# EAGLE design 10BASE-T1L (EAGLE 9.6.2)

## Sheet 1 of 2
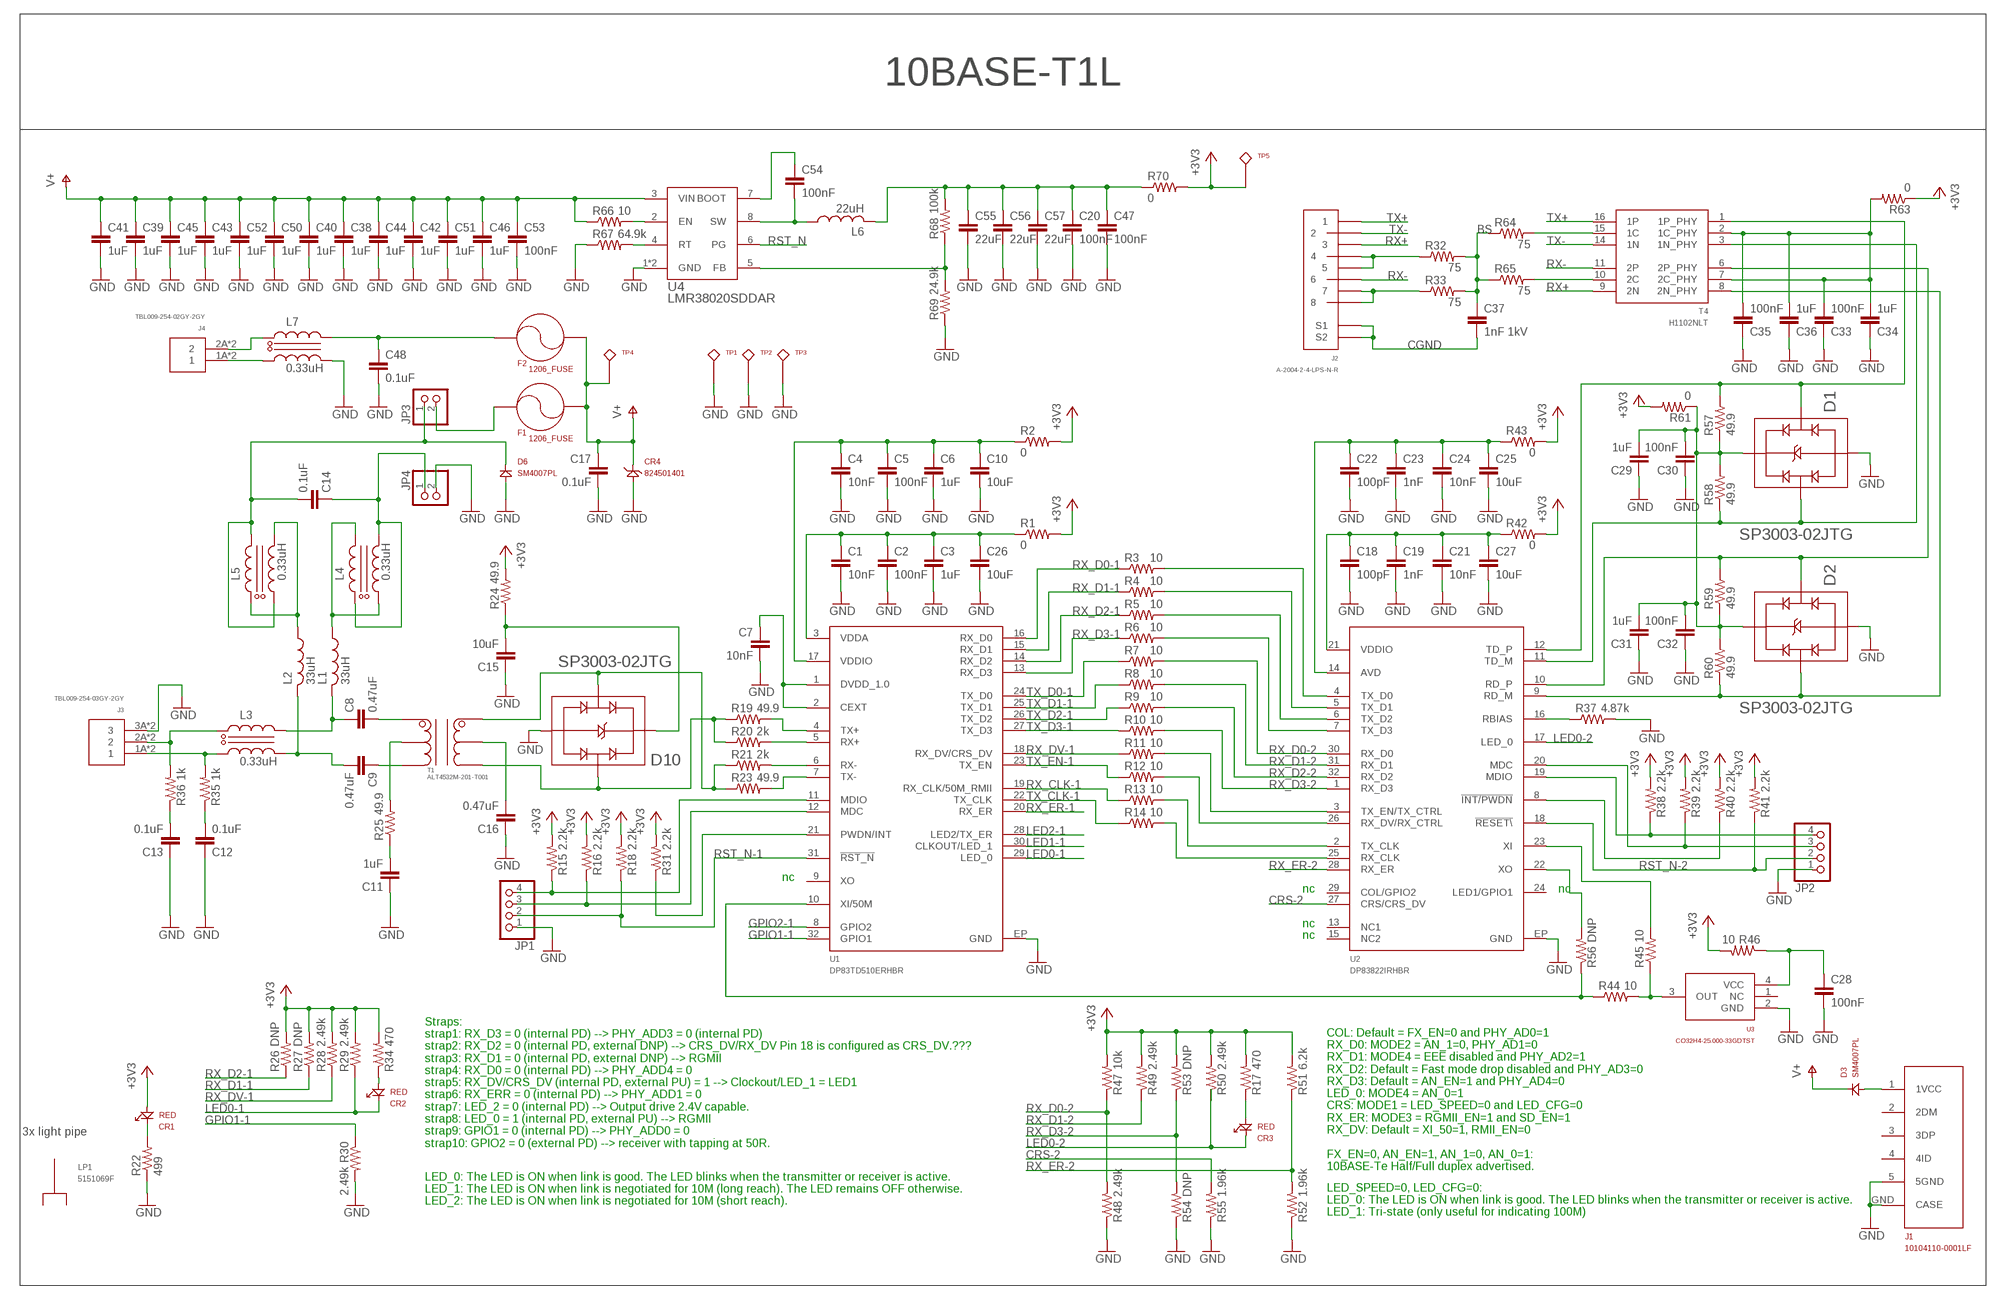
[diagram p0: schematic, sheet 1]

### Parts
C1  10nF  0603_CAPACITOR  [0603]
C2  100nF  0603_CAPACITOR  [0603]
C3  1uF  0603_CAPACITOR  [0603]
C4  10nF  0603_CAPACITOR  [0603]
C5  100nF  0603_CAPACITOR  [0603]
C6  1uF  0603_CAPACITOR  [0603]
C7  10nF  0603_CAPACITOR  [0603]
C8  0.47uF  0603_CAPACITOR  [0603]
C9  0.47uF  0603_CAPACITOR  [0603]
C10  10uF  0805_CAPACITOR  [0805]
C11  1uF  0603_CAPACITOR  [0603]
C12  0.1uF  0603_CAPACITOR  [0603]
C13  0.1uF  0603_CAPACITOR  [0603]
C14  0.1uF  0603_CAPACITOR  [0603]
C15  10uF  0603_CAPACITOR  [0603]
C16  0.47uF  0603_CAPACITOR  [0603]
C17  0.1uF  0603_CAPACITOR  [0603]
C18  100pF  0603_CAPACITOR  [0603]
C19  1nF  0603_CAPACITOR  [0603]
C20  100nF  0603_CAPACITOR  [0603]
C21  10nF  0603_CAPACITOR  [0603]
C22  100pF  0603_CAPACITOR  [0603]
C23  1nF  0603_CAPACITOR  [0603]
C24  10nF  0603_CAPACITOR  [0603]
C25  10uF  0805_CAPACITOR  [0805]
C26  10uF  0805_CAPACITOR  [0805]
C27  10uF  0805_CAPACITOR  [0805]
C28  100nF  0603_CAPACITOR  [0603]
C29  1uF  0603_CAPACITOR  [0603]
C30  100nF  0603_CAPACITOR  [0603]
C31  1uF  0603_CAPACITOR  [0603]
C32  100nF  0603_CAPACITOR  [0603]
C33  100nF  0603_CAPACITOR  [0603]
C34  1uF  0603_CAPACITOR  [0603]
C35  100nF  0603_CAPACITOR  [0603]
C36  1uF  0603_CAPACITOR  [0603]
C37  1nF 1kV  C-EUC1206  [C1206]
C38  1uF  C-EUC1206  [C1206]
C39  1uF  C-EUC1206  [C1206]
C40  1uF  C-EUC1206  [C1206]
C41  1uF  C-EUC1206  [C1206]
C42  1uF  C-EUC1206  [C1206]
C43  1uF  C-EUC1206  [C1206]
C44  1uF  C-EUC1206  [C1206]
C45  1uF  C-EUC1206  [C1206]
C46  1uF  C-EUC1206  [C1206]
C47  100nF  0603_CAPACITOR  [0603]
C48  0.1uF  0603_CAPACITOR  [0603]
C50  1uF  C-EUC1206  [C1206]
C51  1uF  C-EUC1206  [C1206]
C52  1uF  C-EUC1206  [C1206]
C53  100nF  0603_CAPACITOR  [0603]
C54  100nF  0603_CAPACITOR  [0603]
C55  22uF  C-EUC1206  [C1206]
C56  22uF  C-EUC1206  [C1206]
C57  22uF  C-EUC1206  [C1206]
CR1  RED  150060RS75000  [0603_DIODE]
CR2  RED  150060RS75000  [0603_DIODE]
CR3  RED  150060RS75000  [0603_DIODE]
CR4  824501401  [DO-214AC]
D1  SP3003-02JTG  [SC-70-5]
D2  SP3003-02JTG  [SC-70-5]
D3  SM4007PL  [SOD123(AK)]
D6  SM4007PL  [SOD123(AK)]
D10  SP3003-02JTG  [SC-70-5]
F1  1206_FUSE  [1206]
F2  1206_FUSE  [1206]
J1  10104110-0001LF  [MICRO_USB]
J2  A-2004-2-4-LPS-N-R  [A-2004-2-4-LPS-N-R]
J3  TBL009-254-03GY-2GY  [TBL009-254-03GY-2GY]
J4  TBL009-254-02GY-2GY  [TBL009-254-02GY-2GY]
JP1  PINHD-1X4  [1X04]
JP2  PINHD-1X4  [1X04]
JP3  PINHD-1X2  [1X02]
JP4  PINHD-1X2  [1X02]
L1  33uH  FWP201610P-R33ML  [0806]
L2  33uH  FWP201610P-R33ML  [0806]
L3  0.33uH  SDCW2520S-2-601TF  [SDCW2520]
L4  0.33uH  SDCW2520S-2-601TF  [SDCW2520]
L5  0.33uH  SDCW2520S-2-601TF  [SDCW2520]
L6  22uH  APW12A10  [APW12A10]
L7  0.33uH  SDCW2520S-2-601TF  [SDCW2520]
LP1  5151069F  [5151069F]
R1  0  0603_RESISTOR  [0603]
R2  0  0603_RESISTOR  [0603]
R3  10  0603_RESISTOR  [0603]
R4  10  0603_RESISTOR  [0603]
R5  10  0603_RESISTOR  [0603]
R6  10  0603_RESISTOR  [0603]
R7  10  0603_RESISTOR  [0603]
R8  10  0603_RESISTOR  [0603]
R9  10  0603_RESISTOR  [0603]
R10  10  0603_RESISTOR  [0603]
R11  10  0603_RESISTOR  [0603]
R12  10  0603_RESISTOR  [0603]
R13  10  0603_RESISTOR  [0603]
R14  10  0603_RESISTOR  [0603]
R15  2.2k  0603_RESISTOR  [0603]
R16  2.2k  0603_RESISTOR  [0603]
R17  470  0603_RESISTOR  [0603]
R18  2.2k  0603_RESISTOR  [0603]
R19  49.9  0603_RESISTOR  [0603]
R20  2k  0603_RESISTOR  [0603]
R21  2k  0603_RESISTOR  [0603]
R22  499  0603_RESISTOR  [0603]
R23  49.9  0603_RESISTOR  [0603]
R24  49.9  0603_RESISTOR  [0603]
R25  49.9  0603_RESISTOR  [0603]
R26  DNP  0603_RESISTOR  [0603]
R27  DNP  0603_RESISTOR  [0603]
R28  2.49k  0603_RESISTOR  [0603]
R29  2.49k  0603_RESISTOR  [0603]
R30  2.49k  0603_RESISTOR  [0603]
R31  2.2k  0603_RESISTOR  [0603]
R32  75  0603_RESISTOR  [0603]
R33  75  0603_RESISTOR  [0603]
R34  470  0603_RESISTOR  [0603]
R35  1k  0603_RESISTOR  [0603]
R36  1k  0603_RESISTOR  [0603]
R37  4.87k  0603_RESISTOR  [0603]
R38  2.2k  0603_RESISTOR  [0603]
R39  2.2k  0603_RESISTOR  [0603]
R40  2.2k  0603_RESISTOR  [0603]
R41  2.2k  0603_RESISTOR  [0603]
R42  0  0603_RESISTOR  [0603]
R43  0  0603_RESISTOR  [0603]
R44  10  0603_RESISTOR  [0603]
R45  10  0603_RESISTOR  [0603]
R46  10  0603_RESISTOR  [0603]
R47  10k  0603_RESISTOR  [0603]
R48  2.49k  0603_RESISTOR  [0603]
R49  2.49k  0603_RESISTOR  [0603]
R50  2.49k  0603_RESISTOR  [0603]
R51  6.2k  0603_RESISTOR  [0603]
R52  1.96k  0603_RESISTOR  [0603]
R53  DNP  0603_RESISTOR  [0603]
R54  DNP  0603_RESISTOR  [0603]
R55  1.96k  0603_RESISTOR  [0603]
R56  DNP  0603_RESISTOR  [0603]
R57  49.9  0603_RESISTOR  [0603]
R58  49.9  0603_RESISTOR  [0603]
R59  49.9  0603_RESISTOR  [0603]
R60  49.9  0603_RESISTOR  [0603]
R61  0  0603_RESISTOR  [0603]
R63  0  0603_RESISTOR  [0603]
R64  75  0603_RESISTOR  [0603]
R65  75  0603_RESISTOR  [0603]
R66  10  0603_RESISTOR  [0603]
R67  64.9k  0603_RESISTOR  [0603]
R68  100k  0603_RESISTOR  [0603]
R69  24.9k  0603_RESISTOR  [0603]
R70  0  0603_RESISTOR  [0603]
T1  ALT4532M-201-T001  [TDK_ALT]
T4  H1102NLT  [H1102NLT]
TP1  5011  [5010]
TP2  5011  [5010]
TP3  5011  [5010]
TP4  5010  [5010]
TP5  5010  [5010]
U1  DP83TD510ERHBR  [QFN32-55_TI]
U2  DP83822IRHBR  [QFN32-55_TI]
U3  CO32H4-25.000-33GDTST  [3.2X2.5_4SMD]
U4  LMR38020SDDAR  [SOIC8_TP_TI]

### Nets
3V3R: C20.1 C47.1 C55.1 C56.1 C57.1 L6.P$2 R68.2 R70.1
+3V3: CR1.A R1.2 R2.2 R15.2 R16.2 R17.2 R18.2 R24.2 R26.2 R27.2 R28.2 R29.2 R31.2 R34.2 R38.2 R39.2 R40.2 R41.2 R42.2 R43.2 R46.2 R47.2 R49.2 R50.2 R51.2 R53.2 R61.2 R63.1 R70.2 TP5.P$1
BS: C37.1 R32.2 R33.2 R64.1 R65.1
CEXT_L: C7.1 U1.1(DVDD_1.0) U1.2(CEXT)
CGND: C37.2 J2.S1 J2.S2
CRS-2: R55.2 U2.27(CRS/CRS_DV)
GND: C1.2 C2.2 C3.2 C4.2 C5.2 C6.2 C7.2 C10.2 C11.1 C12.1 C13.1 C15.1 C16.1 C17.2 C18.2 C19.2 C20.2 C21.2 C22.2 C23.2 C24.2 C25.2 C26.2 C27.2 C28.2 C29.1 C30.1 C31.1 C32.1 C33.1 C34.1 C35.1 C36.1 C38.2 C39.2 C40.2 C41.2 C42.2 C43.2 C44.2 C45.2 C46.2 C47.2 C48.2 C50.2 C51.2 C52.2 C53.2 C55.2 C56.2 C57.2 CR4.A D1.2(GND) D2.2(GND) D6.A D10.2(GND) J1.5(5GND) J1.GND(CASE) J3.3A J3.3B JP1.1 JP2.1 JP4.2 L7.B2(2OUT) R22.1 R30.2 R37.2 R48.1 R52.1 R54.1 R55.1 R67.1 R69.1 TP1.P$1 TP2.P$1 TP3.P$1 U1.EP(GND) U2.EP(GND) U3.2(GND) U4.1(GND) U4.TP(GND)
GPIO1-1: R30.1 U1.32(GPIO1)
GPIO2-1: U1.8(GPIO2)
LED0-1: CR2.K R29.1 U1.29(LED_0)
LED0-2: CR3.K R50.1 U2.17(LED_0)
LED1-1: U1.30(CLKOUT/LED_1)
LED2-1: U1.28(LED2/TX_ER)
N$1: C48.1 F2.1 L7.A2(1OUT)
N$2: C8.2 T1.1
N$3: CR3.A R17.1
N$4: J2.4 J2.5 R32.1
N$5: J2.7 J2.8 R33.1
N$6: CR2.A R34.1
N$7: JP1.4 R15.1 U1.11(MDIO)
N$8: JP1.3 R16.1 U1.12(MDC)
N$9: R31.1 U1.21(PWDN/INT)
N$10: D3.A J1.1(1VCC)
N$11: R56.2 U2.22(XO)
N$12: J4.1A J4.1B L7.B1(2IN)
N$13: R14.2 U2.25(RX_CLK)
N$14: C9.1 T1.2
N$16: R25.2 T1.6
N$17: C8.1 L1.P$2 L3.A2(1OUT)
N$18: C9.2 L2.P$2 L3.B2(2OUT)
N$19: CR1.K R22.2
N$20: L1.P$1 L4.A2(1OUT) L4.B1(2IN)
N$21: L2.P$1 L5.A1(1IN) L5.B2(2OUT)
N$22: R13.2 U2.2(TX_CLK)
N$24: R12.2 U2.26(RX_DV/RX_CTRL)
N$25: R11.2 U2.3(TX_EN/TX_CTRL)
N$26: C14.2 D6.K JP3.1 L5.A2(1OUT) L5.B1(2IN)
N$28: C14.1 JP4.1 L4.A1(1IN) L4.B2(2OUT)
N$29: R64.2 T4.15(1C)
N$30: R6.2 U2.7(TX_D3)
N$31: R5.2 U2.6(TX_D2)
N$32: R4.2 U2.5(TX_D1)
N$33: R3.2 U2.4(TX_D0)
N$34: J4.2A J4.2B L7.A1(1IN)
N$35: F1.1 JP3.2
N$36: J3.1A J3.1B L3.B1(2IN) R35.2
N$37: C11.2 R25.1
N$40: C16.2 T1.3
N$41: R45.2 U2.23(XI)
N$42: C13.2 R36.1
N$48: C12.2 R35.1
N$49: J3.2A J3.2B L3.A1(1IN) R36.2
N$50: C15.2 D10.3(VCC) R24.1
N$56: JP2.3 R39.1 U2.20(MDC)
N$57: JP2.4 R38.1 U2.19(MDIO)
N$58: R40.1 U2.8(!INT/PWDN)
N$59: R68.1 R69.2 U4.5(FB)
N$60: R37.1 U2.16(RBIAS)
N$61: R44.2 R45.1 U3.3(OUT)
N$62: C28.1 R46.1 U3.4(VCC)
N$63: R44.1 R56.1 U1.10(XI/50M)
N$64: R65.2 T4.10(2C)
N$68: C54.1 U4.7(BOOT)
N$71: R67.2 U4.4(RT)
N$72: R66.2 U4.2(EN)
RD_N [Diff]: D2.5(IO1) R60.1 T4.8(2N_PHY) U2.9(RD_M)
RD_P [Diff]: D2.4(IO2) R59.2 T4.6(2P_PHY) U2.10(RD_P)
RST_N [Diff]: U4.6(PG)
RST_N-1 [Diff]: JP1.2 R18.1 U1.31(!RST_N)
RST_N-2 [Diff]: JP2.2 R41.1 U2.18(!RESET\)
RX+: J2.3 T4.9(2N)
RX-: J2.6 T4.11(2P)
RX_CLK-1: R13.1 U1.19(RX_CLK/50M_RMII)
RX_D0-1: R3.1 U1.16(RX_D0)
RX_D0-2: R7.2 R47.1 R48.2 U2.30(RX_D0)
RX_D1-1: R4.1 R27.1 U1.15(RX_D1)
RX_D1-2: R8.2 R49.1 U2.31(RX_D1)
RX_D2-1: R5.1 R26.1 U1.14(RX_D2)
RX_D2-2: R9.2 U2.32(RX_D2)
RX_D3-1: R6.1 U1.13(RX_D3)
RX_D3-2: R10.2 R53.1 R54.2 U2.1(RX_D3)
RX_DV-1: R11.1 R28.1 U1.18(RX_DV/CRS_DV)
RX_ER-1: U1.20(RX_ER)
RX_ER-2: R51.1 R52.2 U2.28(RX_ER)
RXR_N [Diff]: R21.2 U1.6(RX-)
RXR_P [Diff]: R20.2 U1.5(RX+)
SW: C54.2 L6.P$1 U4.8(SW)
T1L_N [Diff]: D10.5(IO1) R21.1 R23.1 T1.5
T1L_P [Diff]: D10.4(IO2) R19.1 R20.1 T1.4
TCT: C33.2 C34.2 C35.2 C36.2 R63.2 T4.2(1C_PHY) T4.7(2C_PHY)
TCT2: C29.2 C30.2 C31.2 C32.2 D1.3(VCC) D2.3(VCC) R57.1 R58.2 R59.1 R60.2 R61.1
TD_N [Diff]: D1.5(IO1) R58.1 T4.3(1N_PHY) U2.11(TD_M)
TD_P [Diff]: D1.4(IO2) R57.2 T4.1(1P_PHY) U2.12(TD_P)
TX+: J2.1 T4.16(1P)
TX-: J2.2 T4.14(1N)
TX_CLK-1: R14.1 U1.22(TX_CLK)
TX_D0-1: R7.1 U1.24(TX_D0)
TX_D1-1: R8.1 U1.25(TX_D1)
TX_D2-1: R9.1 U1.26(TX_D2)
TX_D3-1: R10.1 U1.27(TX_D3)
TX_EN-1: R12.1 U1.23(TX_EN)
TXR_N [Diff]: R23.2 U1.7(TX-)
TXR_P [Diff]: R19.2 U1.4(TX+)
V+ [HV]: C17.1 C38.1 C39.1 C40.1 C41.1 C42.1 C43.1 C44.1 C45.1 C46.1 C50.1 C51.1 C52.1 C53.1 CR4.C(K) D3.K F1.2 F2.2 R66.1 TP4.P$1 U4.3(VIN)
VDDA_L: C1.1 C2.1 C3.1 C26.1 R1.1 U1.3(VDDA)
VDDA_L1: C18.1 C19.1 C21.1 C27.1 R42.1 U2.21(VDDIO)
VDDIO_L: C4.1 C5.1 C6.1 C10.1 R2.1 U1.17(VDDIO)
VDDIO_L1: C22.1 C23.1 C24.1 C25.1 R43.1 U2.14(AVD)
Unconnected: J1.2(2DM) J1.3(3DP) J1.4(4ID) U1.9(XO) U2.13(NC1) U2.15(NC2) U2.24(LED1/GPIO1) U2.29(COL/GPIO2) U3.1(NC)

### Notes on the sheet
- 10BASE-T1L
- nc
- nc | nc
- nc
- nc
- 3x light pipe
- Straps:
  strap1: RX_D3 = 0 (internal PD) --> PHY_ADD3 = 0 (internal PD) 
  strap2: RX_D2 = 0 (internal PD, external DNP) --> CRS_DV/RX_DV Pin 18 is configured as CRS_DV.???
  strap3: RX_D1 = 0 (internal PD, external DNP) --> RGMII
  strap4: RX_D0 = 0 (internal PD) --> PHY_ADD4 = 0
  strap5: RX_DV/CRS_DV (internal PD, external PU) = 1 --> Clockout/LED_1 = LED1
  strap6: RX_ERR = 0 (internal PD) --> PHY_ADD1 = 0
  strap7: LED_2 = 0 (internal PD) --> Output drive 2.4V capable.
  strap8: LED_0 = 1 (internal PD, external PU) --> RGMII
  strap9: GPIO1 = 0 (internal PD) --> PHY_ADD0 = 0
  strap10: GPIO2 = 0 (external PD) --> receiver with tapping at 50R.
- COL: Default = FX_EN=0 and PHY_AD0=1
  RX_D0: MODE2 = AN_1=0, PHY_AD1=0
  RX_D1: MODE4 = EEE disabled and PHY_AD2=1
  RX_D2: Default = Fast mode drop disabled and PHY_AD3=0
  RX_D3: Default = AN_EN=1 and PHY_AD4=0
  LED_0: MODE4 = AN_0=1
  CRS: MODE1 = LED_SPEED=0 and LED_CFG=0
  RX_ER: MODE3 = RGMII_EN=1 and SD_EN=1
  RX_DV: Default = XI_50=1, RMII_EN=0
  
  FX_EN=0, AN_EN=1, AN_1=0, AN_0=1:
  10BASE-Te Half/Full duplex advertised.
- LED_0: The LED is ON when link is good. The LED blinks when the transmitter or receiver is active. 
  LED_1: The LED is ON when link is negotiated for 10M (long reach). The LED remains OFF otherwise. 
  LED_2: The LED is ON when link is negotiated for 10M (short reach).
- LED_SPEED=0, LED_CFG=0:
  LED_0: The LED is ON when link is good. The LED blinks when the transmitter or receiver is active. 
  LED_1: Tri-state (only useful for indicating 100M)

## Sheet 2 of 2

## Library data of the parts
C1-C9 C11-C24 C28-C36 C47 C48 C53 C54 = ruark2:0603_CAPACITOR: 0603 Capacitor -- WARNING: NO DEFINED VALUE OR PART NUMBER; VALUE: sel
C10 C25-C27 = ruark2:0805_CAPACITOR: NO DEFINED PN
C37-C46 C50-C52 C55-C57 = rcl:C-EU: CAPACITOR, European symbol; SPICEPREFIX: C
CR1-CR3 = ruark2:150060RS75000: Red 625nm LED Indication - Discrete 2V 0603 (1608 Metric); PARTNO: 732-4978-1-ND
CR4 = ruark2:824501401: 64.5V Clamp 6.1A Ipp Tvs Diode Surface Mount DO-214AC; PARTNO: 732-9960-1-ND
D1 D2 D10 = ruark2:SP3003-02JTG: 15V Clamp 2.5A (8/20µs) Ipp Tvs Diode Surface Mount SC-70-5 JLCPCB: C151302; PARTNO: F3301CT-ND
D3 D6 = ruark2:SM4007PL: 1A 1kV 1.1V@1A SOD-123FL Diodes - General Purpose ROHS JLCPCB: C64898
F1 F2 = ruark2:1206_FUSE
J1 = ruark2:10104110-0001LF: USB - micro B USB 2.0 Receptacle Connector 5 Position Surface Mount, Right Angle; PARTNO: 609-4052-1-ND
J2 = ruark2:A-2004-2-4-LPS-N-R: Jack Modular Connector 8p8c (RJ45, Ethernet) 90° Angle (Right) Shielded Asian alternate: RCH RC00994; PARTNO: AE10387-ND
J3 = ruark2:TBL009-254-03GY-2GY: 3 Position Wire to Board Terminal Block Horizontal with Board 0.100" (2.54mm) Through Hole; PARTNO: 102-TBL009-254-03GY-2GY-ND
J4 = ruark2:TBL009-254-02GY-2GY: 2 Position Wire to Board Terminal Block Horizontal with Board 0.100" (2.54mm) Through Hole; PARTNO: 102-TBL009-254-02GY-2GY-ND
JP1 JP2 = pinhead:PINHD-1X4: PIN HEADER
JP3 JP4 = pinhead:PINHD-1X2: PIN HEADER
L1 L2 = ruark2:FWP201610P-R33ML: 4.1A 0.33uH ±20% Molding Choke 0806 Power Inductors ROHS
L3-L5 L7 = ruark2:SDCW2520S-2-601TF: 600Ω@100MHz 0.38Ω 2 1008 Common Mode Filters ROHS JLCPCB: C843574
L6 = ruark2:APW12A10: 22uH ±20% 4.95A SMD Power Inductors ROHS JLCPCB: C311499
LP1 = ruark2:5151069F: Light Pipe 3 Wide Clear Rigid Board Mount, Press Fit, Right Angle; PARTNO: 350-2182-ND
R1-R61 R63-R70 = ruark2:0603_RESISTOR: 0603 Resistor -- WARNING: NO DEFINED PART NUMBER OR VALUE; VALUE: sel
T1 = ruark2:ALT4532M-201-T001: 200µH LAN Pulse Transformer 1CT:1CT Surface Mount JLCPCB: C2845101; PARTNO: 445-15085-1-ND
T4 = ruark2:H1102NLT
TP1-TP3 = ruark2:5011: Black PC Test Point, Multipurpose Phosphor Bronze, Silver Plating 0.063" (1.60mm) Hole Diameter Mounting Type; PARTNO: 36-5011-ND
TP4 TP5 = ruark2:5010: Red PC Test Point, Multipurpose Phosphor Bronze, Silver Plating 0.063" (1.60mm) Hole Diameter Mounting Type; PARTNO: 36-5010-ND
U1 = ruark2:DP83TD510ERHBR: 1/1 Transceiver 10BASE-T1L IEEE 802.3 32-VQFN (5x5); PARTNO: 296-DP83TD510ERHBRCT-ND
U2 = ruark2:DP83822IRHBR: 10/100 Ethernet PHY RGMII/RMII/MII; PARTNO: 296-44794-1-ND
U3 = ruark2:CO32H4-25.000-33GDTST: 3.3V~3.3V ±50ppm 25MHz HCMOS SMD3225-4P Oscillators ROHS 4-SMD, No Lead
U4 = ruark2:LMR38020SDDAR: Buck Switching Regulator IC Positive Adjustable 1V 1 Output 2A 8-PowerSOIC (0.154", 3.90mm Width); PARTNO: 296-LMR38020SDDARCT-ND

## Net classes
1 HV: clearance 0.406 mm
2 Diff: width 0.18 mm, clearance 0.152 mm

## Board
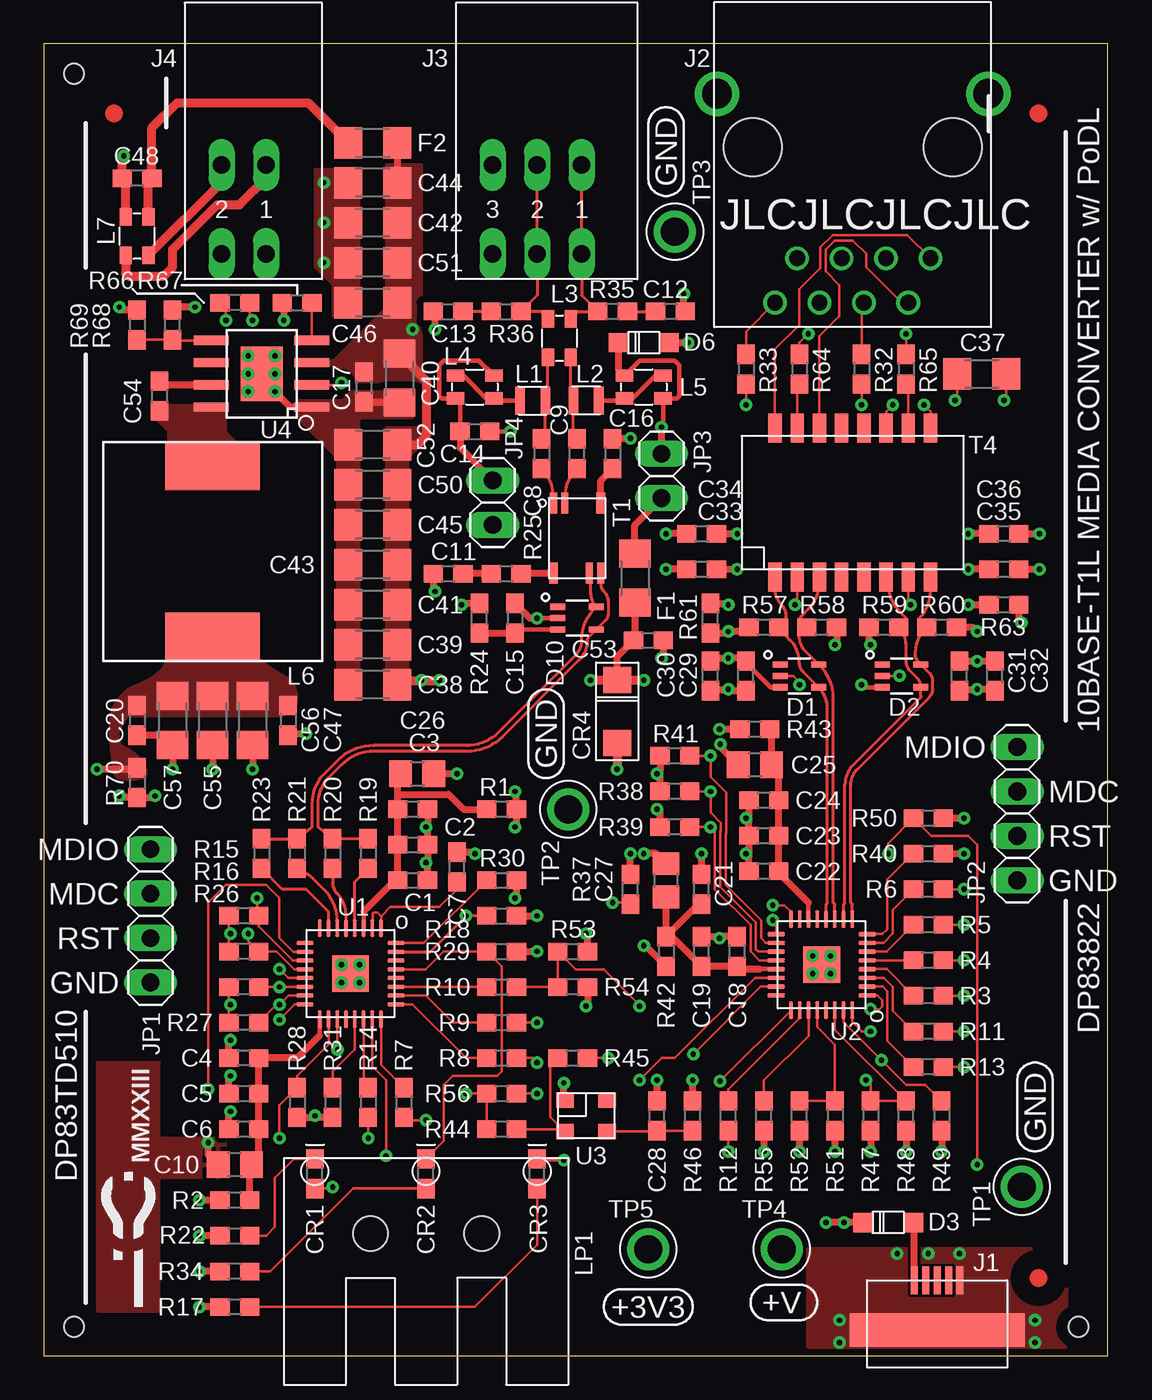
[diagram p1: board, top side]
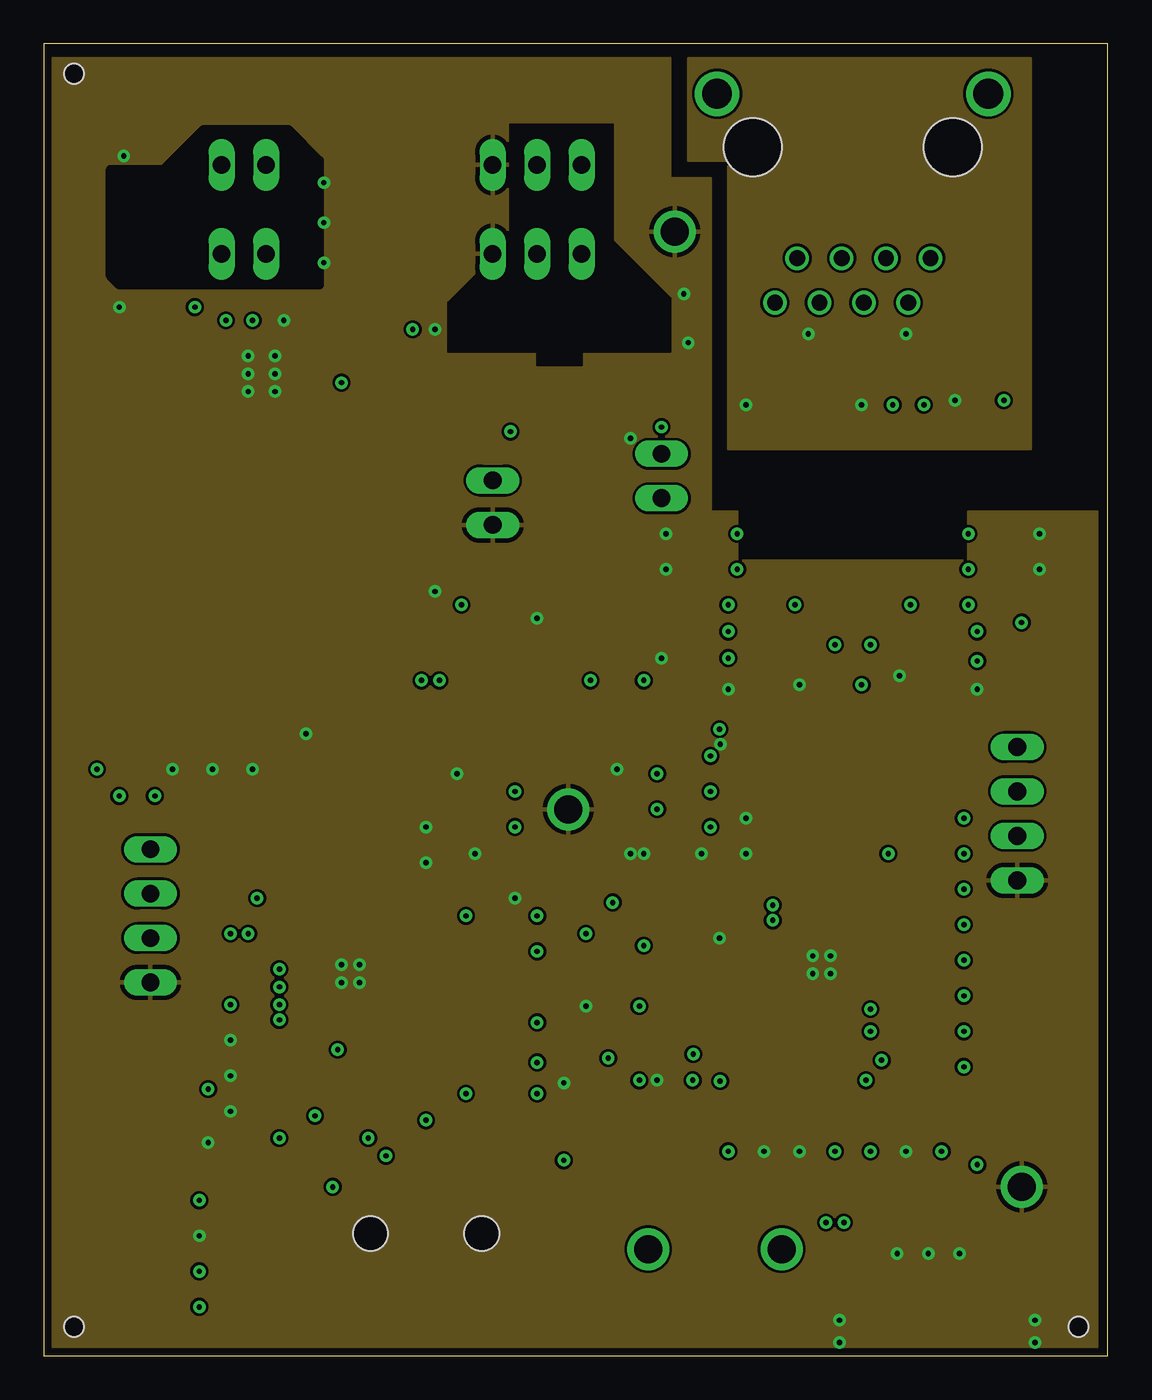
[diagram p2: board, inner layer Route2]
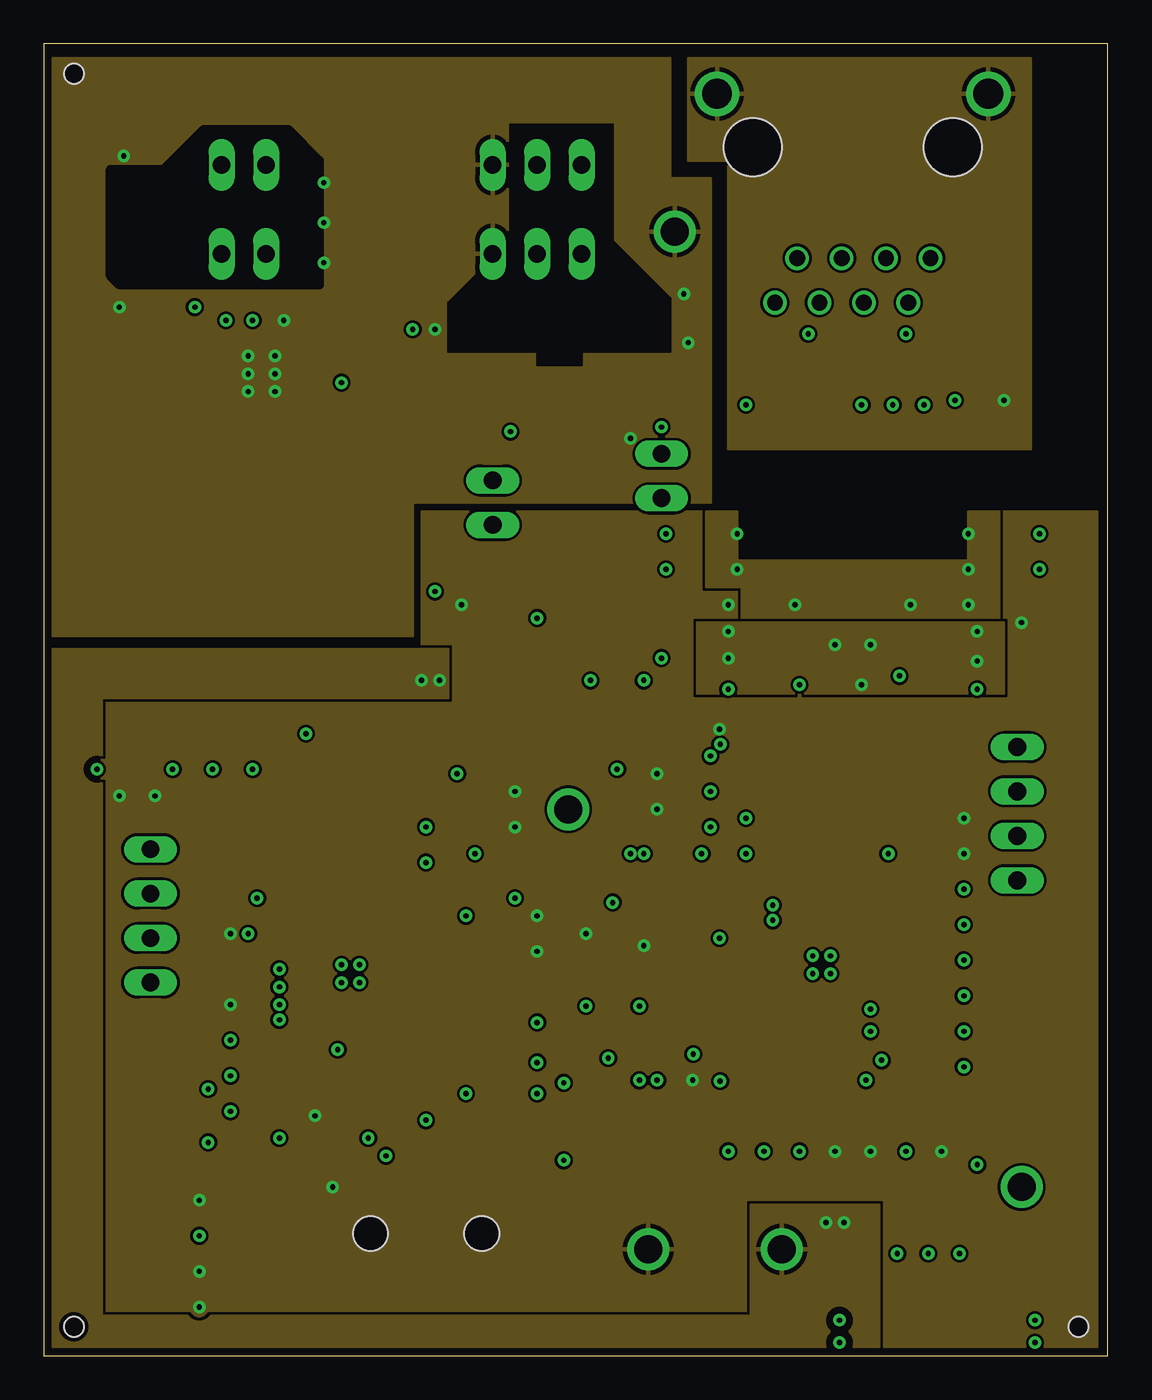
[diagram p3: board, inner layer Route15]
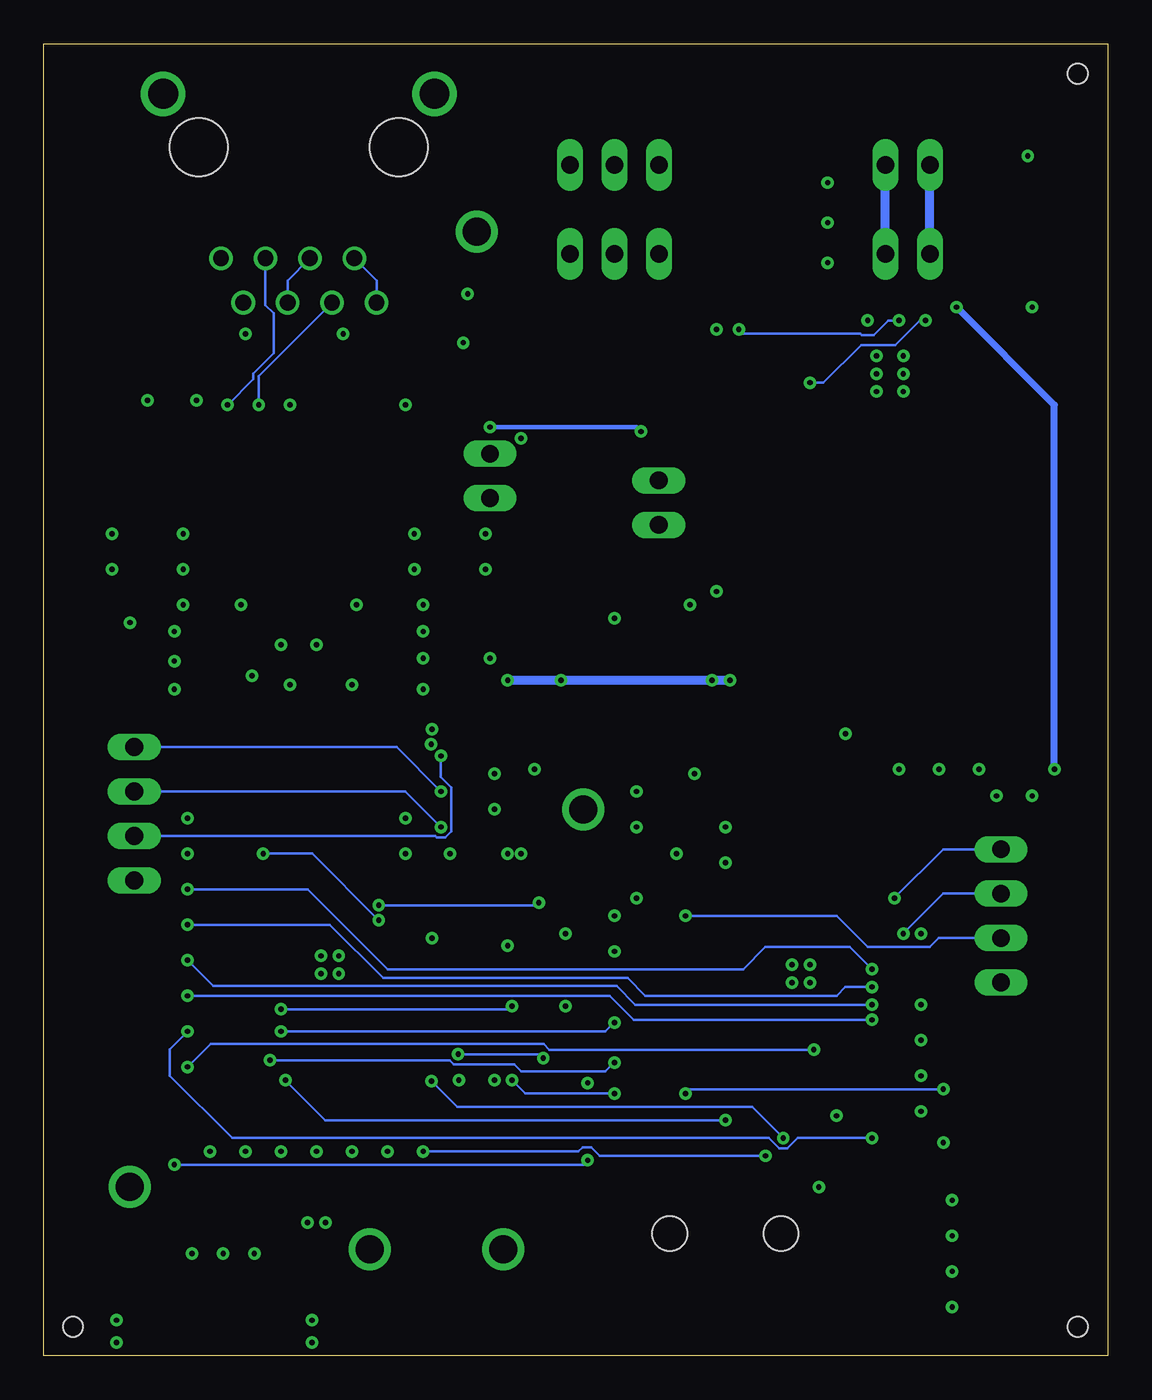
[diagram p4: board, bottom side, seen from below]

Size 60.8 x 75 mm. Coordinates in mm from the lower left corner, seen from the top.
Outline: 0,0 60.8,0 60.8,75 0,75 0,0
Copper layers (1+2*15+16): Top 0.035mm / dielectric 1.5mm / Route2 0.035mm / dielectric 0.15mm / Route15 0.035mm / dielectric 0.2mm / Bottom 0.035mm
Design rules "default *": minimum track width 6mil, minimum drill 12mil, track to track 6mil, track to pad 6mil, pad to pad 6mil, via to via 6mil, smd to smd 6mil, copper to edge 0mil, drill to drill 6mil, minimum pad ring 0.13mm, minimum via ring 8mil, stop-mask expansion 4mil, vias tented up to drill 12mil, thermal gap 10mil
Holes 1.15 mm at 1.73,1.66 1.73,73.29 59.13,1.66
tRestrict: area 0.7,0.6 to 2.7,2.7; area 0.7,72.3 to 2.7,74.3; area 58.1,0.6 to 60.1,2.7; area 2.9,69.9 to 5.1,72.1; area 55.7,69.9 to 57.9,72.1; area 55.7,3.4 to 57.9,5.6
bRestrict: area 16.9,5.2 to 20.4,8.8; area 23.2,5.2 to 26.8,8.8

### Footprints (pad centres in the part's own frame; a part is rotated, then mirrored left to right if it is on the bottom)
0603 = smd 1.1 x 1: 1 -0.85,0; 2 0.85,0
0805 = smd 1.3 x 1.5: 1 -0.95,0; 2 0.95,0
C1206 = smd 1.6 x 1.8: 1 -1.4,0; 2 1.4,0
0603_DIODE = smd 1.1 x 1: A -0.85,0; K 0.85,0
DO-214AC = smd 1.5 x 1.6: A -1.8,0; C 1.8,0
SC-70-5 = smd 0.85 x 0.35: 1 -1.1,0.65; 2 -1.1,0; 3 -1.1,-0.65; 4 1.1,-0.65; 5 1.1,0.65
SOD123(AK) = smd 1.1 x 1.1: A 1.45,0; K -1.45,0
1206 = smd 1.6 x 1.8: 1 -1.4,0; 2 1.4,0
MICRO_USB = smd 0.4 x 1.6: 1 -1.3,0; 2 -0.65,0; 3 0,0; 4 0.65,0; 5 1.3,0 | smd 10 x 1.9: GND 0,-2.84
A-2004-2-4-LPS-N-R = drill 0.9: 1 4.445,-6.35; 2 3.175,-8.89; 3 1.905,-6.35; 4 0.635,-8.89; 5 -0.635,-6.35; 6 -1.905,-8.89; 7 -3.175,-6.35; 8 -4.445,-8.89 | drill 1.7: S1 -7.75,3.05; S2 7.75,3.05 | hole 3.35: -5.715,0; 5.715,0
TBL009-254-03GY-2GY = drill 1 long: 1A -2.54,-2.54; 1B -2.54,2.54; 2A 0,-2.54; 2B 0,2.54; 3A 2.54,-2.54; 3B 2.54,2.54
TBL009-254-02GY-2GY = drill 1 long: 1A -1.27,0; 1B -1.27,5.08; 2A 1.27,0; 2B 1.27,5.08
1X04 = drill 1.016 long: 1 -3.81,0; 2 -1.27,0; 3 1.27,0; 4 3.81,0
1X02 = drill 1.016 long: 1 -1.27,0; 2 1.27,0
0806 = smd 0.55 x 1.6: P$1 -0.725,0; P$2 0.725,0
SDCW2520 = smd 1 x 0.7: A1 -1.1,-0.65; A2 1.1,-0.65; B1 -1.1,0.65; B2 1.1,0.65
APW12A10 = smd 2.8 x 5.4: P$1 4.9,0; P$2 -4.9,0
5151069F = hole 2.007: -3.175,0; 3.175,0
TDK_ALT = smd 1.2 x 0.41: 1 -2,-1.35; 2 -2,-0.7; 4 2,1.35; 5 2,0.7 | smd 1.2 x 0.5: 3 -2,1.35; 6 2,-1.35
H1102NLT = smd 0.762 x 1.651: 1 -4.445,-4.255; 2 -3.175,-4.255; 3 -1.905,-4.255; 4 -0.635,-4.255; 5 0.635,-4.255; 6 1.905,-4.255; 7 3.175,-4.255; 8 4.445,-4.255; 9 4.445,4.255; 10 3.175,4.255; 11 1.905,4.255; 12 0.635,4.255; 13 -0.635,4.255; 14 -1.905,4.255; 15 -3.175,4.255; 16 -4.445,4.255
5010 = drill 1.6: P$1 0,0
QFN32-55_TI = smd 1 x 0.25: 1 -2.6,1.75; 2 -2.6,1.25; 3 -2.6,0.75; 4 -2.6,0.25; 5 -2.6,-0.25; 6 -2.6,-0.75; 7 -2.6,-1.25; 8 -2.6,-1.75; 17 2.6,-1.75; 18 2.6,-1.25; 19 2.6,-0.75; 20 2.6,-0.25; 21 2.6,0.25; 22 2.6,0.75; 23 2.6,1.25; 24 2.6,1.75 | smd 0.25 x 1: 9 -1.75,-2.6; 10 -1.25,-2.6; 11 -0.75,-2.6; 12 -0.25,-2.6; 13 0.25,-2.6; 14 0.75,-2.6; 15 1.25,-2.6; 16 1.75,-2.6; 25 1.75,2.6; 26 1.25,2.6; 27 0.75,2.6; 28 0.25,2.6; 29 -0.25,2.6; 30 -0.75,2.6; 31 -1.25,2.6; 32 -1.75,2.6 | smd 2.1 x 2.1: EP 0,0
3.2X2.5_4SMD = smd 1 x 0.9: 1 1.2,0.9; 2 -1.2,0.9; 3 -1.2,-0.9; 4 1.2,-0.9
SOIC8_TP_TI = smd 1.981 x 0.533: 1 -2.87,1.905; 2 -2.87,0.635; 3 -2.87,-0.635; 4 -2.87,-1.905; 5 2.87,-1.905; 6 2.87,-0.635; 7 2.87,0.635; 8 2.87,1.905 | smd 2.4 x 3.1: TP 0,0

### Placement (x,y rotation side)
C1  21.08,27.18 0 top
C2  21.08,29.21 0 top
C3  21.08,31.24 0 top
C4  11.43,17.02 180 top
C5  11.43,14.99 180 top
C6  11.43,12.95 180 top
C7  23.62,27.94 90 top
C8  28.45,51.56 270 top
C9  30.48,51.56 90 top
C10  10.92,10.92 180 top
C11  23.11,44.7 0 top
C12  35.81,59.69 180 top
C13  23.11,59.69 0 top
C14  24.64,52.83 0 top
C15  26.92,42.16 270 top
C16  32.51,51.56 270 top
C17  18.29,55.37 270 top
C18  39.62,23.11 90 top
C19  37.59,23.11 90 top
C20  5.33,36.32 270 top
C21  37.59,26.67 90 top
C22  41.15,27.69 180 top
C23  41.15,29.72 180 top
C24  41.15,31.75 180 top
C25  40.64,33.78 180 top
C26  21.34,33.27 0 top
C27  35.56,27.18 90 top
C28  35.05,13.72 90 top
C29  40.13,38.86 90 top
C30  38.1,38.86 90 top
C31  52.32,38.86 90 top
C32  54.36,38.86 90 top
C33  37.59,44.96 0 top
C34  37.59,46.99 0 top
C35  54.86,44.96 180 top
C36  54.86,46.99 180 top
C37  53.59,56.13 0 top
C38  18.8,38.35 180 top
C39  18.8,40.64 180 top
C40  20.32,55.88 270 top
C41  18.8,42.93 180 top
C42  18.8,64.77 180 top
C43  18.8,45.21 180 top
C44  18.8,67.06 180 top
C45  18.8,47.5 180 top
C46  18.8,60.2 180 top
C47  13.97,36.32 270 top
C48  5.33,67.31 180 top
C50  18.8,49.78 180 top
C51  18.8,62.48 180 top
C52  18.8,52.07 180 top
C53  34.54,40.89 0 top
C54  6.6,54.86 270 top
C55  9.65,36.32 270 top
C56  11.94,36.32 270 top
C57  7.37,36.32 270 top
CR1  15.49,10.41 90 top
CR2  21.84,10.41 90 top
CR3  28.19,10.41 90 top
CR4  32.77,36.83 90 top
D1  43.18,38.86 0 top
D2  49.02,38.86 0 top
D3  48.26,7.62 0 top
D6  34.29,57.91 0 top
D10  30.48,42.16 0 top
F1  33.78,44.45 270 top
F2  18.8,69.34 0 top
J1  51.05,4.32 0 top
J2  46.23,69.09 0 top
J3  28.19,65.53 180 top
J4  11.43,68.07 180 top
JP1  6.1,25.15 90 top
JP2  55.63,30.99 90 top
JP3  35.31,50.29 270 top
JP4  25.65,48.77 270 top
L1  27.94,54.61 0 top
L2  30.99,54.61 180 top
L3  29.46,58.17 270 top
L4  24.64,55.37 0 top
L5  34.29,55.37 0 top
L6  9.65,45.97 90 top
L7  5.33,64.01 90 top
LP1  21.84,6.99 0 top
R1  26.16,31.24 0 top
R2  10.92,8.89 180 top
R3  50.55,20.57 180 top
R4  50.55,22.61 180 top
R5  50.55,24.64 180 top
R6  50.55,26.67 180 top
R7  20.57,14.48 270 top
R8  26.16,17.02 0 top
R9  26.16,19.05 0 top
R10  26.16,21.08 0 top
R11  50.55,18.54 180 top
R12  39.12,13.72 90 top
R13  50.55,16.51 180 top
R14  18.54,14.48 270 top
R15  11.43,25.15 180 top
R16  11.43,23.11 180 top
R17  10.92,2.79 180 top
R18  26.16,25.15 0 top
R19  18.54,28.7 270 top
R20  16.51,28.7 270 top
R21  14.48,28.7 270 top
R22  10.92,6.86 0 top
R23  12.45,28.7 270 top
R24  24.89,42.16 90 top
R25  26.42,44.7 0 top
R26  11.43,21.08 180 top
R27  11.43,19.05 180 top
R28  14.48,14.48 270 top
R29  26.16,23.11 0 top
R30  26.16,27.18 0 top
R31  16.51,14.48 270 top
R32  46.74,56.39 270 top
R33  40.13,56.39 270 top
R34  10.92,4.83 180 top
R35  32.51,59.69 180 top
R36  26.42,59.69 0 top
R37  33.53,26.67 90 top
R38  36.07,32.26 180 top
R39  36.07,30.23 180 top
R40  50.55,28.7 0 top
R41  36.07,34.29 180 top
R42  35.56,23.11 270 top
R43  40.64,35.81 180 top
R44  26.16,12.95 0 top
R45  30.23,17.02 0 top
R46  37.08,13.72 90 top
R47  47.24,13.72 270 top
R48  49.28,13.72 90 top
R49  51.31,13.72 270 top
R50  50.55,30.73 0 top
R51  45.21,13.72 270 top
R52  43.18,13.72 90 top
R53  30.23,23.11 0 top
R54  30.23,21.08 180 top
R55  41.15,13.72 90 top
R56  26.16,14.99 0 top
R57  41.15,41.66 0 top
R58  44.45,41.66 0 top
R59  48.01,41.66 0 top
R60  51.31,41.66 0 top
R61  38.1,42.16 90 top
R63  54.86,42.93 180 top
R64  43.18,56.39 270 top
R65  49.28,56.39 270 top
R66  10.92,60.2 180 top
R67  14.48,60.2 0 top
R68  7.37,58.93 90 top
R69  5.33,58.93 270 top
R70  5.33,32.77 270 top
T1  30.48,46.74 270 top
T4  46.23,48.77 0 top
TP1  55.88,9.65 90 top
TP2  29.97,31.24 0 top
TP3  36.07,64.26 0 top
TP4  42.16,6.1 0 top
TP5  34.54,6.1 0 top
U1  17.53,21.84 270 top
U2  44.45,22.35 180 top
U3  30.99,13.72 0 top
U4  12.45,56.13 180 top

### Tracks (layer width: path | path; a pad name or v marks a point on that pad's centre or on a via)
3V3R  (via drill 0.3)
  Top 0.406: R70.1 5.25,33.53 v3.05,33.53 | v8.64,59.94 7.53,59.94 R68.2
  Bottom 0.406: v3.05,33.53 3.05,54.36 v8.64,59.94
  pour Top (no thermals): 4.83,36.58 13.46,36.58 arc90 14.48,37.59 arc62 13.72,38.86 arc-11 12.19,39.88 arc-85 11.94,41.66 arc196 11.43,41.91 arc-143 10.41,41.91 arc165 9.14,41.66 arc-126 7.87,40.89 arc64 7.37,40.89 arc63 7.11,40.39 arc-53 6.6,39.12 arc-21 5.33,38.35 arc65 3.81,36.32 arc18 4.06,33.27 arc63 4.32,33.02 arc27 5.59,33.02 arc100 5.84,33.53 arc21 5.33,34.29 arc24 4.57,34.8 arc-47 4.32,35.05 arc-43 4.32,35.81 arc-24
+3V3  (via drill 0.3)
  Top 0.152: R15.2 10.58,24.22 v10.67,24.13 10.58,24.04 R16.2 | R26.2 10.58,20.15 v10.67,20.07 10.58,19.98 R27.2 | CR1.A 16.42,9.56 v16.51,9.65
  Top 0.406: R40.2 v52.58,28.7 | R63.1 55.71,42.08 v55.88,41.91 | R18.2 v28.19,25.15 | R53.2 31.08,24.04 v30.99,24.13 | R42.2 34.38,23.44 v34.29,23.44 | R46.2 v37.08,15.75 | R51.2 v45.21,11.68 | R47.2 v47.24,11.68 | R49.2 v51.31,11.68 | R28.2 15.41,13.63 v15.49,13.72 15.58,13.63 R31.2 | R43.2 v38.61,35.81 | R41.2 35.22,33.44 v35.05,33.27 35.22,33.11 R38.2 | R39.2 35.22,31.08 v35.05,31.24 | R2.2 v8.89,8.89 | R24.2 23.96,43.01 v23.88,42.93 | R34.2 v8.89,4.83 | R17.2 v8.89,2.79 | R29.2 v28.19,23.11 | v26.92,30.23 27.01,30.31 R1.2 27.01,32.17 v26.92,32.26 | R61.2 39.03,43.01 v39.12,42.93 | v4.32,32 4.41,31.92 R70.2 6.26,31.92 v6.35,32 | R50.2 v52.58,30.73
  pour Route15 (rank 3): 0.51,0.51 60.2,0.51 60.2,48.26 52.83,48.26 52.83,45.47 39.62,45.47 39.62,48.26 21.59,48.26 21.59,40.39 0.51,40.39
BS  (via drill 0.3)
  Top 0.152: R32.2 v46.74,54.36 | R65.1 v49.28,58.42 | R64.1 43.18,57.91 v43.69,58.42 | R33.2 v40.13,54.36 | C37.1 52.19,54.61 v52.07,54.61
  pour Route2: 39.12,55.37 39.12,51.82 43.43,51.82 56.39,51.82 56.39,66.55 56.39,74.17 37.59,74.17 36.83,74.17 36.83,69.6 36.83,68.33 38.86,68.33 39.12,68.33
CEXT_L
  Top 0.152: U1.1 19.28,25.12 | C7.1 23.62,26.67 22.61,25.65 19.81,25.65 19.28,25.12 | U1.2 18.8,24.46 18.8,25.3 18.85,25.35 19.05,25.35 19.28,25.12
CGND  (via drill 0.3)
  Top 0.152: C37.2 54.99,54.61 v54.86,54.61
  pour Route15: 39.12,55.37 39.12,51.82 43.43,51.82 56.39,51.82 56.39,66.55 56.39,74.17 37.59,74.17 36.83,74.17 36.83,69.6 36.83,68.33 38.86,68.33 39.12,68.33
CRS-2
  Top 0.152: U2.27 43.7,18.3 41.15,15.75 R55.2
GND  (via drill 0.3)
  Top 0.152: D2.2 v48.9,38.86 | D1.2 42.84,38.86 43.18,38.52 v43.18,38.35 | U4.TP v11.68,56.13
  Top 0.18: U2.EP v43.94,21.84
  Top 0.254: D10.2 v28.19,42.16
  Top 0.406: R48.1 v49.28,11.68 | R52.1 v43.18,11.68 | R55.1 v41.15,11.68 | C28.2 v35.05,15.75 | U3.2 29.72,14.69 v29.72,15.6 | C4.2 10.58,17.95 v10.67,18.03 | C5.2 10.58,15.91 v10.67,16 | C6.2 10.58,13.88 v10.67,13.97 | C10.2 9.4,11.5 v9.4,12.19 | C34.1 v35.56,46.99 | C33.1 v35.56,44.96 | C53.2 35.39,39.97 v35.31,39.88 | C30.1 38.19,38.1 v39.12,38.1 39.2,38.01 C29.1 | C25.2 38.66,34.81 v38.66,34.95 | C24.2 40.3,30.9 v40.13,30.73 40.3,30.57 C23.2 40.3,28.87 v40.13,28.7 40.3,28.54 C22.2 | C21.2 v37.59,28.7 | R37.2 v33.53,28.7 | C27.2 34.99,28.7 v34.29,28.7 | C19.2 38.52,23.96 v38.61,23.88 38.7,23.96 C18.2 | R54.1 31.08,20.08 v30.99,19.99 | R30.2 27.01,26.25 v26.92,26.16 | C7.2 24.55,28.79 v24.64,28.7 | C1.2 21.93,28.11 | 21.93,28.11 v21.84,28.19 | C3.2 21.93,30.31 v21.84,30.23 21.93,30.14 C2.2 21.93,28.11 | C26.2 v23.62,33.27 | C15.1 27.77,42.16 v28.19,42.16 | C31.1 52.41,38.1 v53.34,38.1 54.27,38.1 C32.1 | C56.2 v11.94,33.53 | C55.2 v9.65,33.53 | v7.37,33.53 C57.2 6.82,35.47 C20.2 | C40.2 18.33,54.48 C17.2 | U4.1 14.1,54.23 v13.21,55.12 | R22.1 v8.89,6.86 | C13.1 22.35,59.6 v22.35,58.67 | C12.1 36.58,59.78 v36.58,60.71 | D6.A v36.83,57.91 | C11.1 22.26,43.78 v22.35,43.69 | C47.2 14.06,35.56 v14.99,35.56 | R69.1 4.48,59.78 v4.32,59.94 | R67.1 13.72,60.11 v13.72,59.18 | C16.1 32.55,52.45 v33.53,52.45 | C36.1 v56.9,46.99 | C35.1 v56.9,44.96 | U1.EP v17.02,22.35
  Top 0.508: CR4.A v32.77,33.53 | L7.B2 4.68,67.11 C48.2 4.48,68.49 v4.57,68.58
  other vias: 43.94,22.86 44.96,22.86 44.96,21.84 17.02,21.34 18.03,22.35 18.03,21.34 13.21,56.13 13.21,57.15 11.68,57.15 11.68,55.12 50.55,5.84 48.77,5.84 52.32,5.84 56.64,2.03 56.64,0.76 45.47,0.76 45.47,2.03 16,62.48 16,64.77 16,67.06
  pour Route2 (rank 5): 0.51,74.17 35.81,74.17 35.81,67.31 38.1,67.31 38.1,48.26 39.62,48.26 39.62,45.47 52.83,45.47 52.83,48.26 60.2,48.26 60.2,0.51 0.51,0.51
  pour Top (no thermals): 14.48,54.61 14.48,53.59 16.76,51.31 16.76,37.59 18.03,37.59 18.03,53.59 21.08,53.59 21.08,55.12 17.53,55.12 17.02,54.61
  cutout Route2: 15.75,61.21 4.32,61.21 3.81,61.72 3.81,67.82 6.86,67.82 9.14,70.1 12.19,70.1 13.97,70.1 15.75,68.33
  pour Route15: 0.51,41.15 21.08,41.15 21.08,48.77 38.1,48.77 38.1,67.31 35.81,67.31 35.81,74.17 0.51,74.17
  cutout Route15: 15.75,61.21 4.32,61.21 3.81,61.72 3.81,67.82 6.86,67.82 9.14,70.1 12.19,70.1 13.97,70.1 15.75,68.33
  pour Top (no thermals): 58.42,0.51 43.69,0.51 43.69,6.1 57.4,6.1 58.17,6.1 58.42,6.1
  pour Top (no thermals): 16.51,59.44 18.03,59.44 18.03,67.82 15.49,67.82 15.49,62.23 16.51,61.21
  pour Top: 10.41,10.16 6.6,10.16 6.6,2.54 3.05,2.54 3.05,16.76 6.6,16.76 6.6,12.45 10.41,12.45
GPIO1-1
  Top 0.152: U1.32 21.73,23.59 R30.1
LED0-1
  Top 0.152: U1.29 21.84,22.09 22.86,23.11 R29.1 26.16,22.26 26.16,16.26 25.91,16 23.37,16 22.86,15.49 22.86,12.28 CR2.K
LED0-2  (via drill 0.3)
  Top 0.152: U2.17 41.85,24.7 v41.66,24.89 | v48.26,28.7 48.26,29.3 R50.1 50.71,29.72 52.83,29.72 53.34,29.21 v53.34,10.92 | v29.72,11.18 28.28,11.18 CR3.K
  Bottom 0.152: v41.66,24.89 45.47,28.7 v48.26,28.7 | v53.34,10.92 29.97,10.92 v29.72,11.18
N$1
  Top 0.508: L7.A2 5.98,67.11 C48.1 6.18,70.19 7.62,71.63 15.11,71.63 F2.1
N$2
  Top 0.18: T1.1 29.13,49.07 arc45 C8.2
N$3
  Top 0.152: R17.1 24.64,2.79 28.19,6.35 CR3.A
N$4
  Top 0.152: R32.1 46.74,60.07 J2.4
  Bottom 0.152: J2.5 46.86,61.47 J2.4
N$5
  Top 0.152: R33.1 40.13,58.55 J2.8
  Bottom 0.152: J2.7 41.78,61.47 J2.8
N$6
  Top 0.152: R34.1 12.95,4.83 17.69,9.56 CR2.A
N$7  (via drill 0.3)
  Top 0.152: U1.11 14.24,22.59 12.28,24.55 R15.1 12.19,25.23 v12.19,26.16
  Bottom 0.152: JP1.4 9.4,28.96 v12.19,26.16
N$8  (via drill 0.3)
  Top 0.152: U1.12 14.3,22.09 13.29,23.11 R16.1 11.68,23.71 v11.68,24.13
  Bottom 0.152: JP1.3 9.4,26.42 v11.68,24.13
N$9
  Top 0.152: U1.21 17.78,17.52 16.51,16.26 R31.1
N$10
  Top 0.406: J1.1 49.75,7.58 D3.A
N$11  (via drill 0.3)
  Top 0.152: U2.22 40.65,21.6 36.07,17.02 35.31,17.02 v34.04,15.75 | v28.19,14.99 R56.2
  Bottom 0.152: v34.04,15.75 33.27,14.99 v28.19,14.99
N$12
  Top 0.508: L7.B1 4.68,61.86 4.83,61.72 6.86,61.72 7.37,62.23 7.37,63.25 9.91,65.79 11.18,65.79 12.7,67.31 J4.1A
  Bottom 0.508: J4.1B J4.1A
N$13  (via drill 0.3)
  Top 0.152: U2.25 v38.65,15.7 | R14.2 v18.54,12.45
  Bottom 0.152: v18.54,12.45 20.32,14.22 37.17,14.22 v38.65,15.7
N$14
  Top 0.18: T1.2 29.78,49.02 arc-45 C9.1
N$16
  Top 0.406: T1.6 29.1,44.7 R25.2
N$17
  Top 0.18: C8.1 arc45 28.66,52.94 L1.P$2 arc45 28.81,54.97 L3.A2
N$18
  Top 0.18: C9.2 arc-45 30.26,52.94 L2.P$2 arc-45 30.11,54.97 L3.B2
N$19
  Top 0.152: CR1.K 14.31,11.26 13.21,10.16 13.21,7.37 12.7,6.86 R22.2
N$20
  Top 0.254: L1.P$1 25.85,54.61 L4.A2 25.29,54.72 23.99,56.02 L4.B1
N$21
  Top 0.254: L2.P$1 33.08,54.61 L5.A1 33.64,54.72 34.94,56.02 L5.B2
N$22
  Top 0.152: U2.2 47.94,21.1 48.21,20.83 48.21,18 R13.2
N$24
  Top 0.152: R12.2 39.12,15.24 43.2,19.32 U2.26
N$25
  Top 0.152: U2.3 47.99,21.6 48.51,21.08 48.51,19.72 R11.2
N$26  (via drill 0.3)
  Top 0.254: L5.B1 34.06,56.9 36.07,56.9 36.32,56.64 36.32,54.86 36.18,54.72 L5.A2 35.39,53.17 v35.31,53.09 | v26.67,52.83 C14.2
  Top 0.406: D6.K 32.84,56.37 L5.B1 | JP3.1 v35.31,53.09
  Bottom 0.254: v35.31,53.09 26.92,53.09 v26.67,52.83
N$28
  Top 0.254: L4.B2 24.86,56.9 22.86,56.9 22.61,56.64 22.61,54.86 22.75,54.72 L4.A1 23.79,54.47 C14.1
  Top 0.406: C14.1 23.79,51.9 JP4.1
N$29
  Top 0.152: T4.15 43.05,55.41 R64.2
N$30
  Top 0.152: U2.7 47.99,23.6 48.51,24.13 48.51,25.49 R6.2
N$31
  Top 0.152: U2.6 48.16,23.1 R5.2
N$32
  Top 0.152: U2.5 R4.2
N$33
  Top 0.152: U2.4 48.17,22.1 R3.2
N$34
  Top 0.508: L7.A1 10.16,67.08 J4.2A
  Bottom 0.508: J4.2B J4.2A
N$35
  Top 0.406: F1.1 33.78,47.5 JP3.2
N$36
  Top 0.18: L3.B1 30.54,59.69 R35.2 30.73,60.62 J3.1B J3.1A
N$37
  Top 0.406: R25.1 C11.2
N$40
  Top 0.406: T1.3 31.83,50.03 C16.2
N$41  (via drill 0.3)
  Top 0.152: U2.23 40.98,21.1 v37.12,17.24 | v32.26,17.02 R45.2
  Bottom 0.152: v37.12,17.24 32.48,17.24 v32.26,17.02
N$42
  Top 0.18: R36.1 C13.2
N$48
  Top 0.18: R35.1 C12.2
N$49
  Top 0.18: L3.A1 28.39,59.69 R36.2 28.19,60.62 J3.2B J3.2A
N$50
  Top 0.254: D10.3 27.12,41.51 C15.2
  Top 0.406: R24.1 C15.2
N$56  (via drill 0.3)
  Top 0.152: U2.20 40.9,22.6 40.39,23.11 40.39,24.64 38.35,26.67 38.35,29.97 v38.1,30.23 R39.1
  Bottom 0.152: JP2.3 40.13,32.26 v38.1,30.23
N$57  (via drill 0.3)
  Top 0.152: U2.19 40.83,23.1 40.69,23.24 40.69,24.76 38.66,26.8 38.66,29.96 38.68,29.98 38.68,30.47 38.1,31.05 v38.1,32.26 R38.1
  Bottom 0.152: JP2.4 40.64,34.8 v38.1,32.26
N$58
  Top 0.152: U2.8 47.93,24.1 48.21,24.38 48.21,27.21 R40.1
N$59
  Top 0.152: U4.5 7.41,58.04 R68.1 R69.2
N$60  (via drill 0.3)
  Top 0.152: U2.16 42.7,25.37 42.32,25.76 v41.66,25.76 | v32.51,25.91 33.44,25.91 R37.1
  Bottom 0.152: v41.66,25.76 32.66,25.76 v32.51,25.91
N$61
  Top 0.152: R45.1 28.96,16.6 28.96,13.65 U3.3 29.65,12.95 R44.2
N$62
  Top 0.152: U3.4 35,12.82 C28.1 R46.1
N$63  (via drill 0.3)
  Top 0.152: U1.10 14.24,23.09 13.46,23.88 13.46,26.16 12.7,26.92 10.41,26.92 9.4,25.91 v9.4,15.24 | R44.1 R56.1 v24.13,14.99
  Bottom 0.152: v9.4,15.24 23.88,15.24 v24.13,14.99
N$64
  Top 0.152: T4.10 49.4,55.41 R65.2
N$68
  Top 0.406: U4.7 6.82,55.5 C54.1
N$71
  Top 0.152: U4.4 15.32,60.19 R67.2
N$72  (via drill 0.3)
  Top 0.152: R66.2 10.41,59.86 v10.41,59.18 | v17.02,55.63 16.89,55.5 U4.2
  Bottom 0.152: v10.41,59.18 10.75,59.18 12.15,57.78 14.1,57.78 16.26,55.63 v17.02,55.63
NNN
  cutout Route2: 26.67,70.36 26.67,63.75 23.11,60.2 23.11,57.4 28.19,57.4 28.19,56.64 30.73,56.64 30.73,57.4 35.81,57.4 35.81,60.45 32.51,63.75 32.51,70.36
  cutout Route15: 26.67,70.36 26.67,63.75 23.11,60.2 23.11,57.4 28.19,57.4 28.19,56.64 30.73,56.64 30.73,57.4 35.81,57.4 35.81,60.45 32.51,63.75 32.51,70.36
RD_N
  Top 0.18: T4.8 50.67,43.7 arc-45 50.04,42.16 arc45 50.1,42.01 R60.1 50.38,41.58 arc45 49.78,40.13 arc45 49.98,39.65 D2.5 50.64,38.99 arc-45 50.8,38.61 50.8,38.1 arc-45 50.62,37.67 46.48,33.53 arc45 46.12,32.65 46.12,25.9 46.2,25.81 U2.9
RD_P
  Top 0.152: 48.26,44.39 T4.6
  Top 0.18: 48.26,44.39 48.26,44.23 arc45 49,42.44 49.28,42.16 arc-45 49.21,42.01 R59.2 arc-45 49.28,40.64 49.28,39.73 arc45 49.53,39.12 49.9,38.74 arc-45 D2.4 50.12,37.73 arc-45 50.06,37.57 46.25,33.76 arc45 45.78,32.65 45.78,25.9 45.7,25.81 U2.10
RST_N-1  (via drill 0.3)
  Top 0.18: U1.31 22.08,23.09 v24.13,25.15 R18.1
  Bottom 0.152: JP1.2 9.65,23.88 10.16,23.37 13.72,23.37 15.49,25.15 v24.13,25.15
RST_N-2  (via drill 0.3)
  Top 0.152: U2.18 41.27,23.6 41,23.88 41,24.89 38.96,26.92 38.96,29.83 38.99,29.86 38.99,32.2 38.1,33.08 v38.1,34.29 R41.1
  Bottom 0.152: v38.1,34.29 38.1,33.08 37.52,32.5 37.52,29.98 37.86,29.64 38.34,29.64 38.42,29.72 JP2.2
RX+  (via drill 0.3)
  Top 0.152: T4.9 50.67,53.98 v50.29,54.36
  Bottom 0.152: v50.29,54.36 48.82,55.83 48.82,56.13 47.65,57.3 47.65,59.59 48.13,60.07 J2.3
RX-  (via drill 0.3)
  Top 0.152: T4.11 48.13,53.98 v48.51,54.36
  Bottom 0.152: J2.6 48.51,56.01 v48.51,54.36
RX_CLK-1  (via drill 0.3)
  Top 0.152: R13.1 v52.58,16.51 | U1.19 16.78,17.51 v16.8,17.49
  Bottom 0.152: v16.8,17.49 31.91,17.49 32.24,17.82 51.26,17.82 v52.58,16.51
RX_D0-1  (via drill 0.3)
  Top 0.152: R3.1 v52.58,20.57 | U1.16 14.35,20.09 v13.46,19.2
  Bottom 0.152: v13.46,19.2 27.08,19.2 28.45,20.57 v52.58,20.57
RX_D0-2  (via drill 0.3)
  Top 0.152: U2.30 45.2,18.64 R48.2 R47.1 47.24,15.49 v46.99,15.75 | v21.84,13.46 20.74,13.46 R7.2
  Bottom 0.152: v46.99,15.75 44.7,13.46 v21.84,13.46
RX_D1-1  (via drill 0.3)
  Top 0.152: R4.1 v52.58,22.61 | R27.1 13.3,20.07 v13.46,20.07 13.99,20.59 U1.15
  Bottom 0.152: v13.46,20.07 27,20.07 28.07,21.13 51.1,21.13 v52.58,22.61
RX_D1-2  (via drill 0.3)
  Top 0.152: R49.1 50.38,15.49 49.28,15.49 v47.88,16.89 45.7,19.07 U2.31 | R8.2 27.94,17.02 v28.19,16.76
  Bottom 0.152: v28.19,16.76 28.7,16.26 33.53,16.26 33.93,16.66 37.36,16.66 37.59,16.89 v47.88,16.89
RX_D2-1  (via drill 0.3)
  Top 0.152: R5.1 v52.58,24.64 | R26.1 12.29,21.09 12.3,21.08 v13.46,21.08 13.47,21.09 U1.14
  Bottom 0.152: v52.58,24.64 44.45,24.64 41.4,21.59 27.43,21.59 26.42,20.57 15.49,20.57 14.99,21.08 v13.46,21.08
RX_D2-2  (via drill 0.3)
  Top 0.152: v47.24,18.54 46.74,18.54 46.2,19.08 U2.32 | v28.19,19.05 R9.2
  Bottom 0.152: v47.24,18.54 28.7,18.54 v28.19,19.05
RX_D3-1  (via drill 0.3)
  Top 0.152: R6.1 v52.58,26.67 | U1.13 13.97,21.59 v13.46,22.1
  Bottom 0.152: v52.58,26.67 45.72,26.67 41.15,22.1 20.83,22.1 19.56,23.37 14.73,23.37 v13.46,22.1
RX_D3-2  (via drill 0.3)
  Top 0.152: R10.2 R54.2 R53.1 30.39,22.1 32,22.1 34.04,20.07 v34.04,19.99 | U2.1 47.62,20.6 47.9,20.32 47.9,19.96 47.75,19.81 v47.24,19.81
  Bottom 0.152: v34.04,19.99 34.21,19.81 v47.24,19.81
RX_DV-1  (via drill 0.3)
  Top 0.152: R11.1 v52.58,18.54 | U1.18 16.28,17.8 14.48,16 R28.1 13.46,14.31 v13.46,12.45
  Bottom 0.152: v13.46,12.45 17.72,12.45 18.3,11.86 18.78,11.86 19.37,12.45 50.04,12.45 53.59,16 53.59,17.53 v52.58,18.54
RX_ER-2
  Top 0.152: U2.28 44.2,18.79 45.21,17.78 R51.1 R52.2
RXR_N
  Top 0.152: R21.2 14.48,27.69
  Top 0.18: U1.6 16.78,24.84 arc45 16.03,26.64 15.35,27.33 arc45 14.48,27.69
RXR_P
  Top 0.18: R20.2 16.51,27.03 arc45 16.76,26.42 arc-45 17.28,25.18 U1.5
SW
  pour Top (no thermals): 10.41,54.36 6.35,54.36 6.35,53.59 7.11,52.83 7.11,49.78 12.19,49.78 12.19,52.07 11.18,52.07 10.41,52.83
T1L_N
  Top 0.18: T1.5 arc-45 31.24,44.59 31.24,43.63 arc45 D10.5 31.48,42.71 arc45 30.73,40.92 30.73,40.89 arc-45 30.38,40.03 25.97,35.62 arc-45 24.17,34.88 18.83,34.88 arc45 16.8,34.03 16.02,33.26 arc45 15.33,31.58 15.33,30.23 R21.1 R23.1
T1L_P
  Top 0.18: T1.4 31.83,44.11 arc45 32,43.69 arc-45 32.26,43.08 32.26,42.42 arc-45 32.1,42.03 D10.4 31.14,41.08 arc45 31.07,40.89 arc-45 30.61,39.79 26.2,35.38 arc-45 24.17,34.54 18.83,34.54 arc45 17.04,33.8 16.26,33.02 arc45 15.66,31.58 15.66,30.23 R20.1 R19.1
TCT  (via drill 0.3)
  Top 0.152: T4.2 43.05,43.05 v42.93,42.93 | T4.7 49.4,43.05 v49.53,42.93
  Top 0.406: C34.2 v39.62,46.99 | C33.2 v39.62,44.96 | C36.2 v52.83,46.99 | C35.2 v52.83,44.96 | R63.2 v52.83,42.93
  pour Route15 (rank 2): 37.85,48.26 37.85,43.94 39.88,43.94 39.88,42.16 54.61,42.16 54.61,48.26 52.83,48.26 52.83,45.47 39.62,45.47 39.62,48.26
TCT2  (via drill 0.3)
  Top 0.152: 46.74,41.24 R59.1 | 40.3,39.71 C29.2
  Top 0.254: D2.3 46.88,38.21 v46.74,38.35 | D1.3 41.54,38.21 40.3,39.46 40.3,39.71
  Top 0.406: R59.1 47.16,40.73 v47.24,40.64 | R58.2 45.3,40.73 v45.21,40.64 | R61.1 39.03,41.31 v39.12,41.4 40.04,41.4 R57.1 | C30.2 38.27,39.88 v39.12,39.88 39.97,39.88 C29.2 | R60.2 53.09,41.66 v53.34,41.4 | C31.2 v53.34,39.71 C32.2
  pour Route15: 54.86,41.91 37.34,41.91 37.34,37.85 54.86,37.85
TD_N
  Top 0.18: U2.11 45.2,25.81 45.12,25.9 45.12,37.62 arc45 44.37,39.42 D1.5 43.56,40.23 arc-45 43.18,41.15 arc-45 43.24,41.3 R58.1 arc-45 43.32,41.77 43.18,41.91 arc-45 43.36,42.34 43.69,42.67 arc45 44.32,44.2 T4.3
TD_P
  Top 0.18: U2.12 44.7,25.81 44.78,25.9 44.78,37 arc45 D1.4 43.4,39.09 arc-45 43.18,39.62 arc45 42.64,40.92 42.42,41.15 arc45 42.36,41.3 R57.2 arc-45 42.06,41.81 42.42,42.16 42.42,42.31 arc45 42.16,42.93 arc-45 41.78,43.85 T4.1
TX+
  Top 0.152: T4.16 41.78,57.53 43.18,58.93 43.18,60.96 44.38,62.16 44.38,63.36 45.09,64.06 49.35,64.06 J2.1
TX-
  Top 0.152: T4.14 44.32,58.29 45.47,59.44 45.47,61.21 44.69,61.99 44.69,63.23 45.21,63.75 46.23,63.75 46.99,62.99 46.99,62.23 49.02,60.2 J2.2
TX_CLK-1
  Top 0.152: U1.22 18.28,15.59 R14.1
TX_D0-1
  Top 0.152: R7.1 19.28,16.63 U1.24
TX_D1-1
  Top 0.152: U1.25 21.05,20.09 24.13,17.02 R8.1
TX_D2-1
  Top 0.152: U1.26 21.82,20.59 23.37,19.05 R9.1
TX_D3-1
  Top 0.152: U1.27 25.3,21.09 R10.1
TX_EN-1  (via drill 0.3)
  Top 0.152: U1.23 18.78,16.53 19.56,15.75 v19.56,11.43 | v39.12,11.68 R12.1
  Bottom 0.152: v19.56,11.43 29.03,11.43 29.52,11.92 30.01,11.92 30.25,11.68 v39.12,11.68
TXR_N
  Top 0.18: U1.7 16.28,25.38 14.99,26.67 13.63,26.67 R23.2
TXR_P
  Top 0.18: U1.4 17.78,27.09 R19.2
V+  (via drill 0.3)
  Top 0.152: R66.1 11.77,59.35 v11.94,59.18
  Top 0.406: F1.2 33.78,40.98 C53.1 32.77,39.97 CR4.C | v45.72,7.62 D3.K v44.7,7.62 | F2.2 C44.1
  Top 0.508: C40.1 21.84,55.76 21.84,52.58 21.34,52.07 C52.1 | C38.1 20.45,38.61 v21.59,38.61 v22.61,38.61 | v34.29,38.61 34.27,38.63 CR4.C 32.74,38.61 v31.24,38.61
  Bottom 0.152: v11.94,59.18 12.53,59.18 13.37,58.34 14.06,58.34 14.14,58.42 20.83,58.42 v21.08,58.67
  Bottom 0.508: v21.59,38.61 v22.61,38.61 v31.24,38.61 v34.29,38.61
  pour Top (rank 2, no thermals): 19.56,37.59 20.83,37.59 20.83,51.31 21.84,52.32 21.84,53.09 19.56,53.09
  pour Top (rank 2, no thermals): 14.48,56.64 16.51,56.64 17.53,55.63 21.59,55.63 21.59,68.07 19.56,68.07 19.56,59.94 16.51,56.9 14.48,56.9
  pour Route15 (isolate 0.254): 47.75,8.64 47.75,0.51 0.51,0.51 0.51,40.39 23.11,40.39 23.11,37.59 3.3,37.59 3.3,2.29 40.39,2.29 40.39,8.64
VDDA_L
  Top 0.254: U1.3 18.28,25.39 18.29,25.4
  Top 0.406: 18.29,25.4 20.07,27.18 C1.1 C2.1 C3.1 20.23,32.1 | 20.23,32.1 20.23,33.12 C26.1 | R1.1 23.99,31.24 23.14,32.1 20.23,32.1
VDDA_L1
  Top 0.254: U2.21 40.9,22.1 40.89,22.1
  Top 0.406: 40.89,22.1 39.79,22.1 C18.1 C19.1 35.89,23.96 R42.1 | R42.1 C27.1 | C21.1 37.42,25.82 R42.1
VDDIO_L
  Top 0.254: U1.17 15.78,18.32 15.75,18.29
  Top 0.406: 15.75,18.29 14.48,17.02 C4.1 C5.1 C6.1 12.28,11.33 C10.1 11.77,10.82 R2.1
VDDIO_L1
  Top 0.254: U2.14 43.69,24.96 43.69,25.91
  Top 0.406: 43.69,25.91 42,27.6 C22.1 C23.1 C24.1 42,33.37 C25.1 41.59,35.71 R43.1
(copper drawn outside any net)
  shapes: Top circle x3

### Text on the board
tPlace: 10BASE-T1L MEDIA CONVERTER w/ PoDL | GND | JLCJLCJLCJLC | GND | MDIO | MDC | RST | MDIO | GND | MDC | DP83822 | RST | GND | DP83TD510 | GND | MMXXIII | +3V3 | +V
tStop: 054